# Altium project BaseStation.PrjPCB
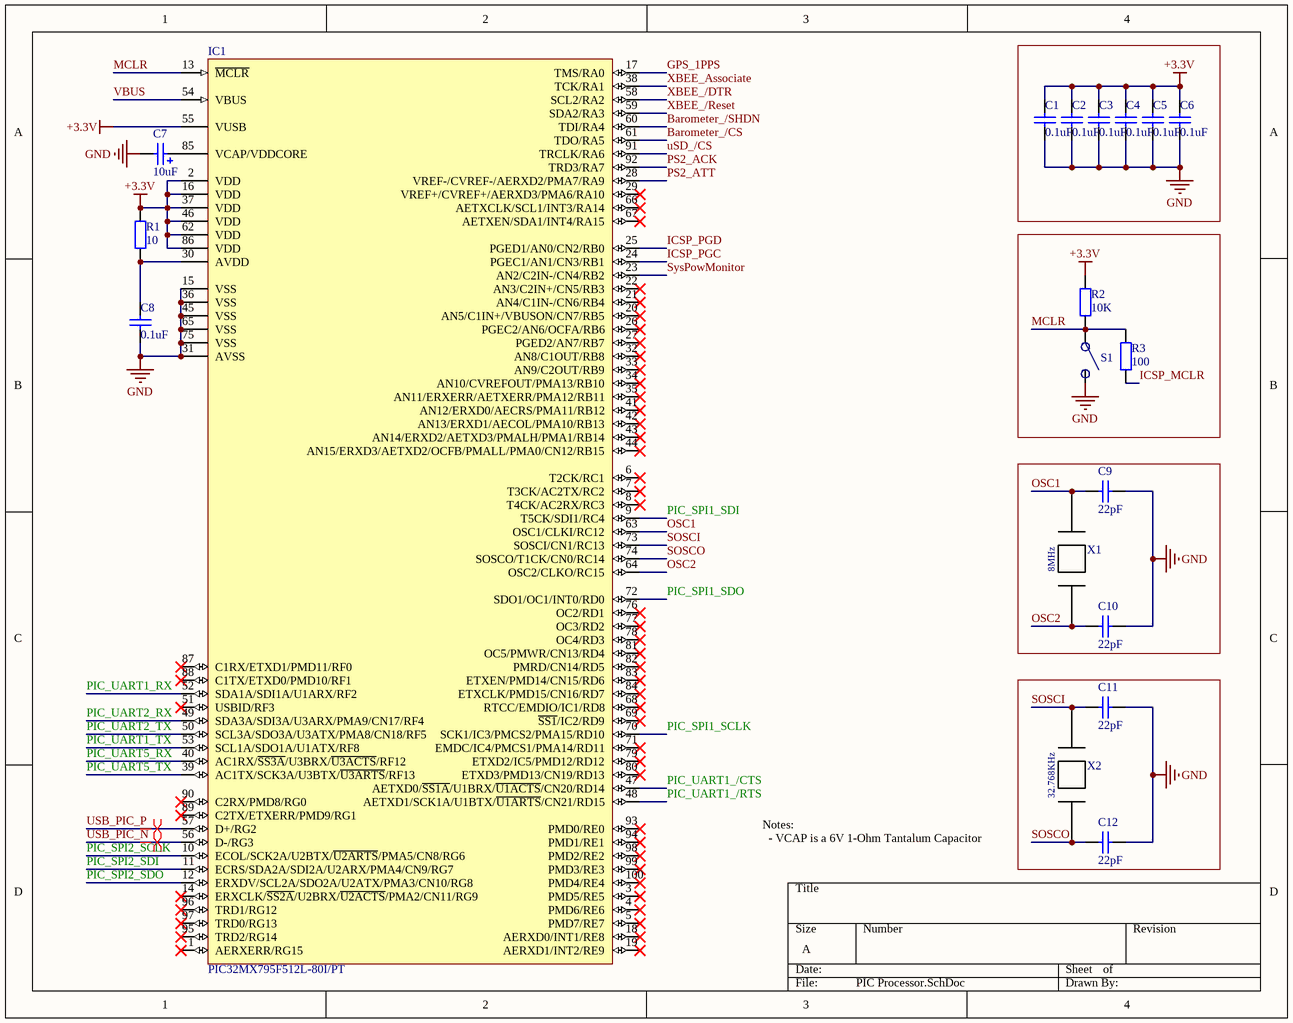
[diagram p0: PIC Processor.SchDoc]
4 sheets, 74 parts. Net scope: global (net labels, ports and power ports of the same name join across sheets).
Board file: Basestation.PcbDoc
Sheets:
  PIC Processor.SchDoc
  Connectors.SchDoc
  Power.SchDoc
  Modules.SchDoc

## Sheet PIC Processor.SchDoc
size A

### Parts
C1  value 0.1uF  [SMD 1206]  (hidden comment: 0.1uF SMD 1206)
C2  value 0.1uF  [SMD 1206]  (hidden comment: 0.1uF SMD 1206)
C3  value 0.1uF  [SMD 1206]  (hidden comment: 0.1uF SMD 1206)
C4  value 0.1uF  [SMD 1206]  (hidden comment: 0.1uF SMD 1206)
C5  value 0.1uF  [SMD 1206]  (hidden comment: 0.1uF SMD 1206)
C6  value 0.1uF  [SMD 1206]  (hidden comment: 0.1uF SMD 1206)
C7  value 10uF  [Capacitor - Tantalum Case A]  (hidden comment: 10uF Low-ESR Tantalum CaseA)
C8  value 0.1uF  [SMD 1206]  (hidden comment: 0.1uF SMD 1206)
C9  value 22pF  [SMD 1206]  (hidden comment: 22pF SMD 1206)
C10  value 22pF  [SMD 1206]  (hidden comment: 22pF SMD 1206)
C11  value 22pF  [SMD 1206]  (hidden comment: 22pF SMD 1206)
C12  value 22pF  [SMD 1206]  (hidden comment: 22pF SMD 1206)
IC1  PIC32MX795F512L-80I/PT  [TQFP-PF100_L]
R1  value 10  [SMD 0805]  (hidden comment: 10 SMD 0805)
R2  value 10K  [SMD 0805]  (hidden comment: 10K SMD 0805)
R3  value 100  [SMD 0805]  (hidden comment: 100 SMD 0805)
S1  Reset  [SMD Tactile Switch]  (value not drawn)
X1  XT9M20ANA8M  [XT9M20ANA8M - 8MHz Capacitor]  (value not drawn)
X2  SSP-T6-7PF-20PPM  [32.768KHz Crystal]  (value not drawn)

### Nets
+3.3V: C1.1 C2.1 C3.1 C4.1 C5.1 C6.1 IC1.2(VDD) IC1.16(VDD) IC1.37(VDD) IC1.46(VDD) IC1.55(VUSB) IC1.62(VDD) IC1.86(VDD) R1.2 R2.2
GND: C1.2 C2.2 C3.2 C4.2 C5.2 C6.2 C7.2(-) C8.2 C9.1 C10.1 C11.1 C12.1 IC1.15(VSS) IC1.31(AVSS) IC1.36(VSS) IC1.45(VSS) IC1.65(VSS) IC1.75(VSS) S1.1
Barometer_/CS: IC1.61(TDO/RA5)
Barometer_/SHDN: IC1.60(TDI/RA4)
GPS_1PPS: IC1.17(TMS/RA0)
ICSP_MCLR: R3.2
ICSP_PGC: IC1.24(PGEC1/AN1/CN3/RB1)
ICSP_PGD: IC1.25(PGED1/AN0/CN2/RB0)
MCLR: IC1.13(~{MCLR}) R2.1 R3.1 S1.2
OSC1: C9.2 IC1.63(OSC1/CLKI/RC12) X1.1
OSC2: C10.2 IC1.64(OSC2/CLKO/RC15) X1.0
PIC_SPI1_SCLK: IC1.70(SCK1/IC3/PMCS2/PMA15/RD10)
PIC_SPI1_SDI: IC1.9(T5CK/SDI1/RC4)
PIC_SPI1_SDO: IC1.72(SDO1/OC1/INT0/RD0)
PIC_SPI2_SCLK: IC1.10(ECOL/SCK2A/U2BTX/~{U2ARTS}/PMA5/CN8/RG6)
PIC_SPI2_SDI: IC1.11(ECRS/SDA2A/SDI2A/U2ARX/PMA4/CN9/RG7)
PIC_SPI2_SDO: IC1.12(ERXDV/SCL2A/SDO2A/U2ATX/PMA3/CN10/RG8)
PIC_UART1_/CTS: IC1.47(AETXD0/~{SS1A}/U1BRX/~{U1ACTS}/CN20/RD14)
PIC_UART1_/RTS: IC1.48(AETXD1/SCK1A/U1BTX/~{U1ARTS}/CN21/RD15)
PIC_UART1_RX: IC1.52(SDA1A/SDI1A/U1ARX/RF2)
PIC_UART1_TX: IC1.53(SCL1A/SDO1A/U1ATX/RF8)
PIC_UART2_RX: IC1.49(SDA3A/SDI3A/U3ARX/PMA9/CN17/RF4)
PIC_UART2_TX: IC1.50(SCL3A/SDO3A/U3ATX/PMA8/CN18/RF5)
PIC_UART5_RX: IC1.40(AC1RX/~{SS3A}/U3BRX/~{U3ACTS}/RF12)  [project net Bluetooth_TX]
PIC_UART5_TX: IC1.39(AC1TX/SCK3A/U3BTX/~{U3ARTS}/RF13)  [project net Bluetooth_RX]
PS2_ACK: IC1.92(TRD3/RA7)
PS2_ATT: IC1.28(VREF-/CVREF-/AERXD2/PMA7/RA9)
SOSCI: C11.2 IC1.73(SOSCI/CN1/RC13) X2.0
SOSCO: C12.2 IC1.74(SOSCO/T1CK/CN0/RC14) X2.1
SysPowMonitor: IC1.23(AN2/C2IN-/CN4/RB2)
USB_PIC_N: IC1.56(D-/RG3)
USB_PIC_P: IC1.57(D+/RG2)
uSD_/CS: IC1.91(TRCLK/RA6)
VBUS: IC1.54(VBUS)
XBEE_/DTR: IC1.58(SCL2/RA2)
XBEE_/Reset: IC1.59(SDA2/RA3)
XBEE_Associate: IC1.38(TCK/RA1)
NetC7_1: C7.1(+) IC1.85(VCAP/VDDCORE)
NetC8_1: C8.1 IC1.30(AVDD) R1.1

Not connected (* = marked no-connect by the designer): IC1 1(AERXERR/RG15)* 3(PMD5/RE5)* 4(PMD6/RE6)* 5(PMD7/RE7)* 6(T2CK/RC1)* 7(T3CK/AC2TX/RC2)* 8(T4CK/AC2RX/RC3)* 14(ERXCLK/~{SS2A}/U2BRX/~{U2ACTS}/PMA2/CN11/RG9)* 18(AERXD0/INT1/RE8)* 19(AERXD1/INT2/RE9)* 20(AN5/C1IN+/VBUSON/CN7/RB5)* 21(AN4/C1IN-/CN6/RB4)* 22(AN3/C2IN+/CN5/RB3)* 26(PGEC2/AN6/OCFA/RB6)* 27(PGED2/AN7/RB7)* 29(VREF+/CVREF+/AERXD3/PMA6/RA10)* 32(AN8/C1OUT/RB8)* 33(AN9/C2OUT/RB9)* 34(AN10/CVREFOUT/PMA13/RB10)* 35(AN11/ERXERR/AETXERR/PMA12/RB11)* 41(AN12/ERXD0/AECRS/PMA11/RB12)* 42(AN13/ERXD1/AECOL/PMA10/RB13)* 43(AN14/ERXD2/AETXD3/PMALH/PMA1/RB14)* 44(AN15/ERXD3/AETXD2/OCFB/PMALL/PMA0/CN12/RB15)* 51(USBID/RF3)* 66(AETXCLK/SCL1/INT3/RA14)* 67(AETXEN/SDA1/INT4/RA15)* 68(RTCC/EMDIO/IC1/RD8)* 69(~{SS1}/IC2/RD9)* 71(EMDC/IC4/PMCS1/PMA14/RD11)* 76(OC2/RD1)* 77(OC3/RD2)* 78(OC4/RD3)* 79(ETXD2/IC5/PMD12/RD12)* 80(ETXD3/PMD13/CN19/RD13)* 81(OC5/PMWR/CN13/RD4)* 82(PMRD/CN14/RD5)* 83(ETXEN/PMD14/CN15/RD6)* 84(ETXCLK/PMD15/CN16/RD7)* 87(C1RX/ETXD1/PMD11/RF0)* 88(C1TX/ETXD0/PMD10/RF1)* 89(C2TX/ETXERR/PMD9/RG1)* 90(C2RX/PMD8/RG0)* 93(PMD0/RE0)* 94(PMD1/RE1)* 95(TRD2/RG14)* 96(TRD1/RG12)* 97(TRD0/RG13)* 98(PMD2/RE2)* 99(PMD3/RE3)* 100(PMD4/RE4)*

### Layout directives
differential pair: USB_PIC_N, USB_PIC_P

### Notes on the sheet
- Notes:
  - VCAP is a 6V 1-Ohm Tantalum Capacitor
- (in symbol SSP-T6-7PF-20PPM) 32.768KHz
- (in symbol XT9M20ANA8M) 8MHz

### Library data of the parts
C1-C6 C8-C12 = Cap: Capacitor
C7 = SMD_Cap_Tantalum: Tantalum Capacitor - Case A
IC1 = PIC32MX795F512L-80I/PT: High Performance 80 MHz MIPS-Based 32-Bit Flash Microcontroller with USB, CAN and Ethernet, 512KB Program Memory, 100-pin TQFP, Industrial Temperature; Published: 2-Dec-2009; DatasheetVersion: revB, Nov-2009; PackageVersion: revBB, Aug-2009; PackageReference: TQFP-PT100; Publisher: Altium Limited; PackageDescription: 100-Lead Plastic Thin Quad Flatpack (PT) - 12x12x1mm Body, 2.00mm [TQFP]; Supplier 1: Digi-Key; Supplier Part Number 1: PIC32MX795F512L-80I/PT-ND; Supplier 2: Farnell; Supplier Part Number 2: 1778492; ComponentLink1Description: Datasheet; ComponentLink1URL: http://ww1.microchip.com/downloads/en/DeviceDoc/DS-61156B.pdf; ComponentLink2Description: Packaging Specification; ComponentLink2URL: http://ww1.microchip.com/downloads/en/PackagingSpec/en012702.pdf; ComponentLink3Description: Microchip.com Home; ComponentLink3URL: http://www.microchip.com/
R1-R3 = Res2: Resistor
S1 = SMD Tactile Switch
X1 = XT9M20ANA8M: 8MHz SMD Crystal; pin to pad: 0>1 1>2
X2 = SSP-T6-7PF-20PPM: 32.768KHz 7pF SMD Crystal; pin to pad: 0>1 1>2

## Sheet Connectors.SchDoc
size A
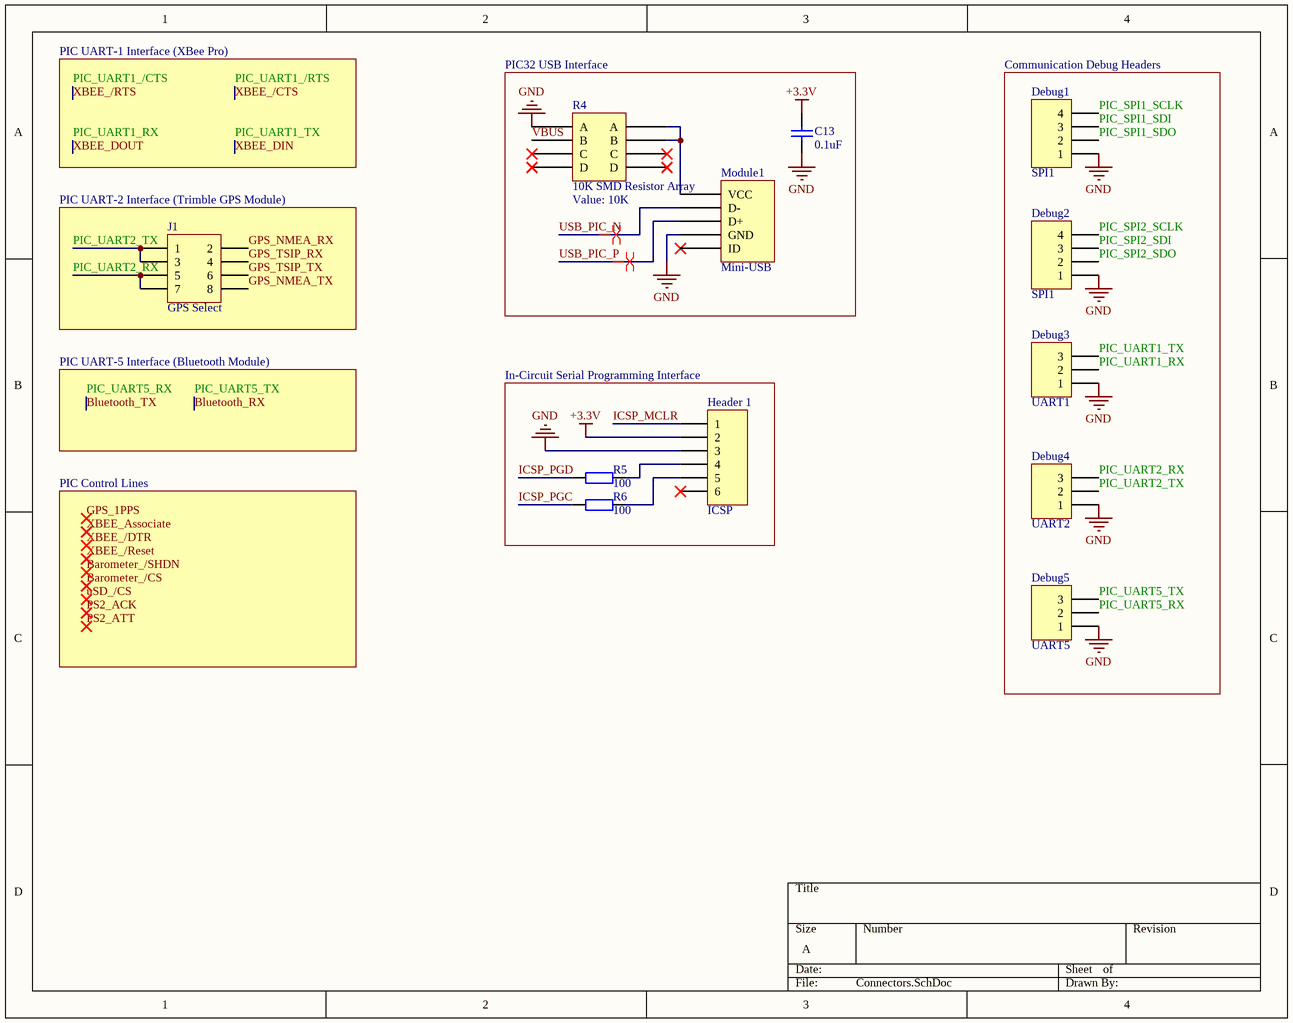
[diagram p1: Connectors.SchDoc]

### Parts
C13  value 0.1uF  [SMD 1206]  (hidden comment: 0.1uF SMD 1206)
Debug1  SPI1  [HDR1X4]
Debug2  SPI1  [HDR1X4]
Debug3  UART1  [HDR1X3]
Debug4  UART2  [HDR1X3]
Debug5  UART5  [HDR1X3]
Header_1  ICSP  [HDR1X6H]
J1  GPS Select  [HDR2X4]
Module1  Mini-USB  [Mini B USB Connector]
R4  10K SMD Resistor Array  value 10K  [Resistor Array YC164]
R5  value 100  [SMD 0805]  (hidden comment: 100 SMD 0805)
R6  value 100  [SMD 0805]  (hidden comment: 100 SMD 0805)

### Blocks framed on the sheet
PIC32 USB Interface: C13 Module1 R4
Communication Debug Headers: Debug1-Debug5
PIC UART-2 Interface (Trimble GPS Module): J1
In-Circuit Serial Programming Interface: Header_1 R5 R6

### Nets
+3.3V: C13.2 Header_1.2
GND: C13.1 Debug1.1 Debug2.1 Debug3.1 Debug4.1 Debug5.1 Header_1.3 Module1.0(GND) R4.5(A)
Bluetooth_RX: Debug5.3  [also labelled PIC_UART5_TX]
Bluetooth_TX: Debug5.2  [also labelled PIC_UART5_RX]
GPS_NMEA_RX: J1.2
GPS_NMEA_TX: J1.8
GPS_TSIP_RX: J1.4
GPS_TSIP_TX: J1.6
ICSP_MCLR: Header_1.1
ICSP_PGC: R6.2
ICSP_PGD: R5.2
PIC_SPI1_SCLK: Debug1.4
PIC_SPI1_SDI: Debug1.3
PIC_SPI1_SDO: Debug1.2
PIC_SPI2_SCLK: Debug2.4
PIC_SPI2_SDI: Debug2.3
PIC_SPI2_SDO: Debug2.2
PIC_UART1_RX: Debug3.2  [also labelled XBEE_DOUT]
PIC_UART1_TX: Debug3.3  [also labelled XBEE_DIN]
PIC_UART2_RX: Debug4.3 J1.5 J1.7
PIC_UART2_TX: Debug4.2 J1.1 J1.3
USB_PIC_N: Module1.3(D-)
USB_PIC_P: Module1.2(D+)
VBUS: R4.6(B)
NetHeader_1_4: Header_1.4 R5.1
NetHeader_1_5: Header_1.5 R6.1
NetModule1_4: Module1.4(VCC) R4.1(A) R4.2(B)

Not connected (* = marked no-connect by the designer): Header_1 6*; Module1 1(ID)*; R4 3(C)* 4(D)* 7(C)* 8(D)*

### Layout directives
differential pair: USB_PIC_N, USB_PIC_P

### Notes on the sheet
- PIC UART-1 Interface (XBee Pro)
- PIC UART-5 Interface (Bluetooth Module)
- PIC Control Lines
- Labels drawn without touching a wire or pin: Barometer_/CS, Barometer_/SHDN, GPS_1PPS, PS2_ACK, PS2_ATT, uSD_/CS, XBEE_/DTR, XBEE_/Reset, XBEE_Associate

### Library data of the parts
C13 = Cap: Capacitor
Debug1 Debug2 = Header 4: Header, 4-Pin; LatestRevisionDate: 17-Jul-2002; LatestRevisionNote: Re-released for DXP Platform.; Publisher: Altium Limited
Debug3-Debug5 = Header 3: Header, 3-Pin; LatestRevisionDate: 17-Jul-2002; LatestRevisionNote: Re-released for DXP Platform.; Publisher: Altium Limited
Header_1 = Header 6: Header, 6-Pin; LatestRevisionDate: 17-Jul-2002; LatestRevisionNote: Re-released for DXP Platform.; Publisher: Altium Limited
J1 = Header 4X2: Header, 4-Pin, Dual row; LatestRevisionDate: 17-Jul-2002; LatestRevisionNote: Re-released for DXP Platform.; Publisher: Altium Limited
Module1 = Mini USB Connector: pin to pad: 0>1 1>2 2>3 3>4 4>5
R4 = SMD Resistor Array: 4-Count Resistor Array; pin to pad: 5>8 6>7 7>6 8>5
R5 R6 = Res2: Resistor

## Sheet Power.SchDoc
size A
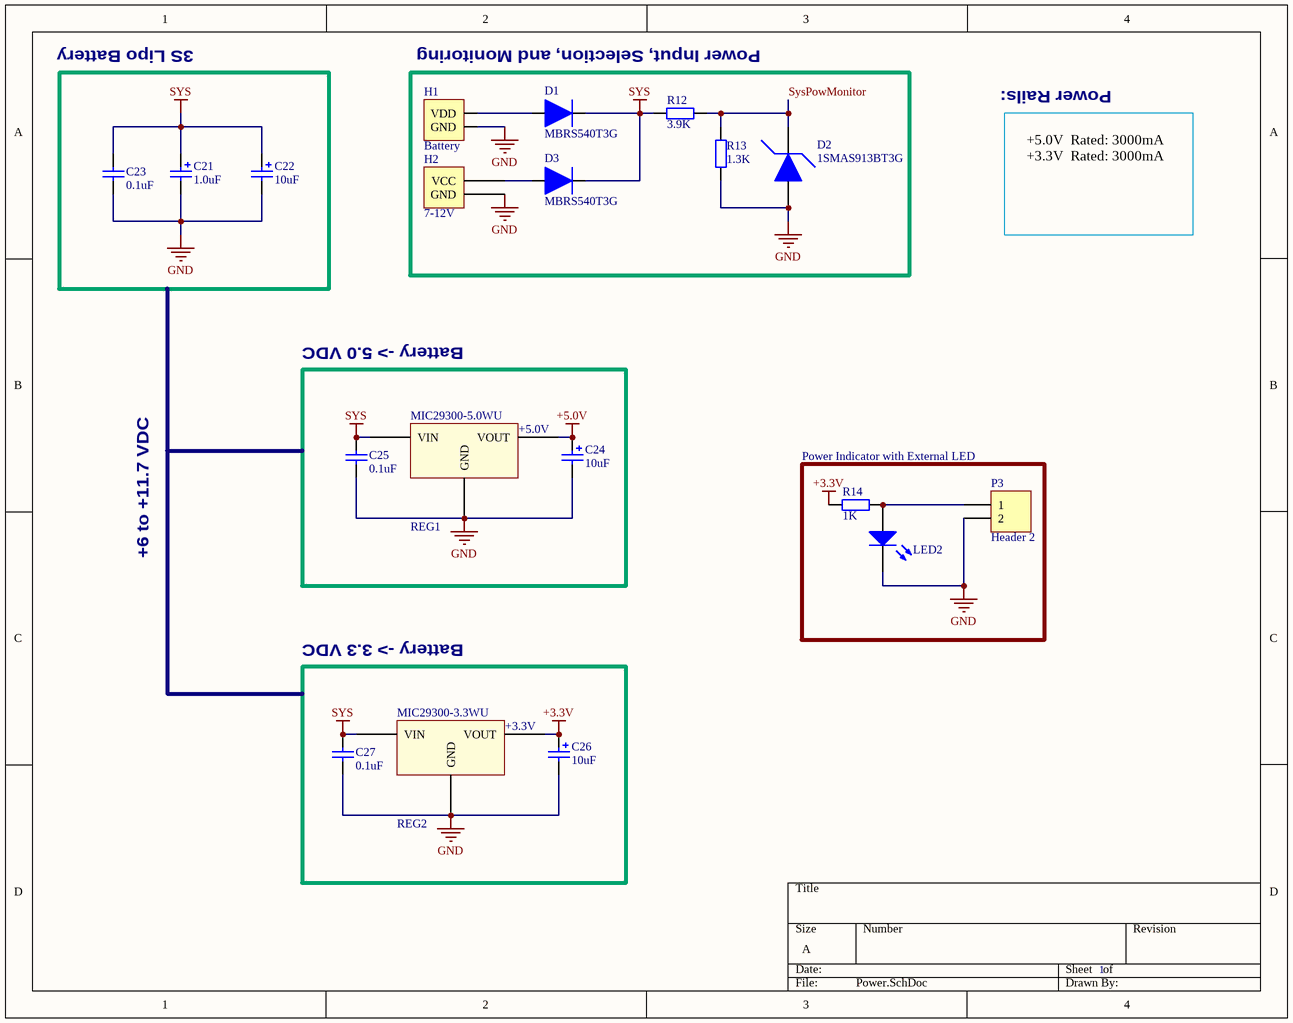
[diagram p2: Power.SchDoc]

### Parts
C21  value 1.0uF  [Capacitor - Tantalum Case A]  (hidden comment: 1.0uF Low-ESR Tantalum CaseA)
C22  value 10uF  [CAPPR2-5x5]  (hidden comment: 10uF Electrolitic)
C23  value 0.1uF  [SMD 1206]  (hidden comment: 0.1uF SMD 1206)
C24  value 10uF  [Capacitor - Tantalum Case A]  (hidden comment: 10uF Low-ESR Tantalum CaseA)
C25  value 0.1uF  [SMD 1206]  (hidden comment: 0.1uF SMD 1206)
C26  value 10uF  [Capacitor - Tantalum Case A]  (hidden comment: 10uF Low-ESR Tantalum CaseA)
C27  value 0.1uF  [SMD 1206]  (hidden comment: 0.1uF SMD 1206)
D1  MBRS540T3G  [MBRS540T3G]
D2  1SMAS913BT3G  [1SMA5913BT3G]
D3  MBRS540T3G  [MBRS540T3G]
H1  Battery  [PC Wire Connector]
H2  7-12V  [DC Power Jack]
LED2  ON  [PLCC-4 LED]  (value not drawn)
P3  Header 2  [HDR1X2]
R12  value 3.9K  [RES12.2-8.5X3.3]  (hidden comment: 3.9K Radial)
R13  value 1.3K  [RES12.2-8.5X3.3]  (hidden comment: 1.3K Radial)
R14  value 1K  [SMD 0805]  (hidden comment: 1K SMD 0805)
REG1  MIC29300-5.0WU  [TO-263 D2PACK]  (value not drawn)
REG2  MIC29300-3.3WU  [TO-263 D2PACK]  (value not drawn)

### Blocks framed on the sheet
Power Indicator with External LED: LED2 P3 R14

### Nets
+3.3V: C26.1(+) R14.1 REG2.2(VOUT)
+5.0V: C24.1(+) REG1.2(VOUT)
GND: C21.2(-) C22.2 C23.1 C24.2(-) C25.2 C26.2(-) C27.1 D2.0(In) H1.R(GND) H2.GND LED2.2(K) P3.2 R13.1 REG1.1(GND) REG2.1(GND)
SYS: C21.1(+) C22.1 C23.2 C25.1 C27.2 D1.1(Out) D3.1(Out) R12.2 REG1.0(VIN) REG2.0(VIN)
SysPowMonitor: D2.1(Out) R12.1 R13.2
NetD1_0: D1.0(In) H1.L(VDD)
NetD3_0: D3.0(In) H2.VCC
NetLED2_1: LED2.1(A) P3.1 R14.2

Not connected (* = marked no-connect by the designer): H2 NC

### Notes on the sheet
- 3S Lipo Battery
- Power Input, Selection, and Monitoring
- Power Rails:
- +5.0V  Rated: 3000mA
  +3.3V  Rated: 3000mA
- Battery -> 5.0 VDC
- +6 to +11.7 VDC
- Battery -> 3.3 VDC
- 1
- (in symbol MIC29300-3.3WU) +3.3V
- (in symbol MIC29300-5.0WU) +5.0V

### Library data of the parts
C21 C24 C26 = SMD_Cap_Tantalum: Tantalum Capacitor - Case A
C22 = Cap Pol1: Polarized Capacitor (Radial); Published: 8-Jun-2000; LatestRevisionDate: 17-Jul-2002; LatestRevisionNote: Re-released for DXP Platform.; PackageReference: RB7.6-15; Publisher: Altium Limited; PackageDescription: Polarized Capacitor (Radial); 2 Leads
C23 C25 C27 = Cap: Capacitor
D1 D3 = MBRS540T3G: 40V 5A Scottky Diode; pin to pad: 0>A 1>K
D2 = 1SMAS913BT3G: 3.3V 1.5W Zener Diode; pin to pad: 0>A 1>K
H1 = PC Wire Connector
H2 = DC Jack: DC Power Jack; pin to pad: GND>OUT VCC>IN
LED2 = SMD LED: Surface Mount Chip LED; pin to pad: 1>2 2>1
P3 = Header 2: Header, 2-Pin; LatestRevisionDate: 17-Jul-2002; LatestRevisionNote: Re-released for DXP Platform.; Publisher: Altium Limited
R12-R14 = Res2: Resistor
REG1 = MIC29300-5.0WU: 3.0A LDO Fixed Volt.(ROHS Compliant); pin to pad: 0>1 1>2 2>3
REG2 = MIC29300-3.3WU: 3.0A LDO Fixed Volt.(ROHS Compliant); pin to pad: 0>1 1>2 2>3

## Sheet Modules.SchDoc
size A
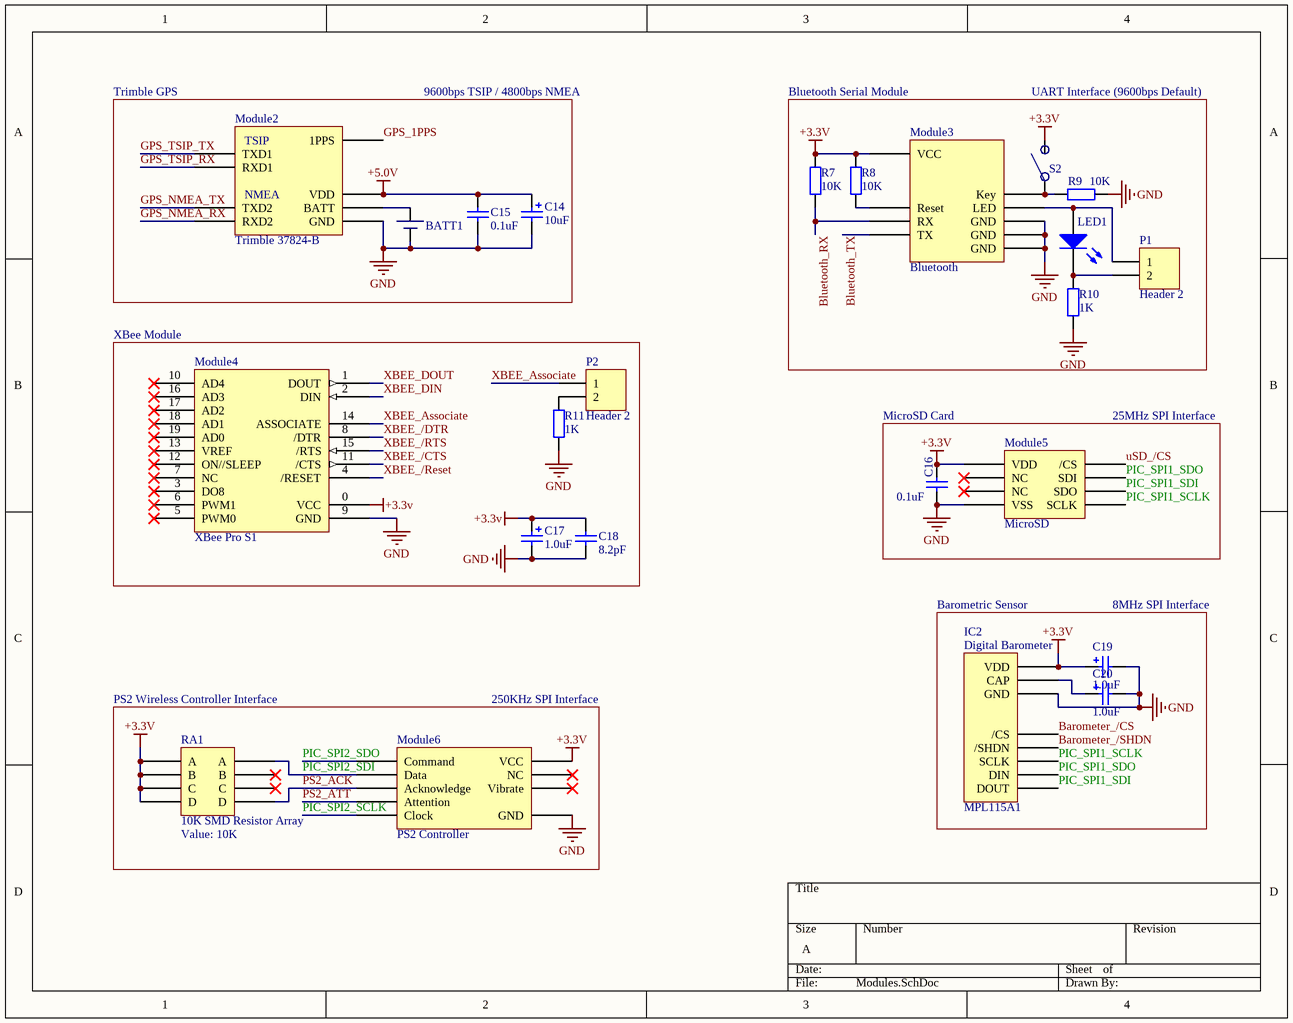
[diagram p3: Modules.SchDoc]

### Parts
BATT1  Coin Cell Holder  [Coil Cell Holder]  (value not drawn)
C14  value 10uF  [Capacitor - Tantalum Case A]  (hidden comment: 10uF Low-ESR Tantalum CaseA)
C15  value 0.1uF  [SMD 1206]  (hidden comment: 0.1uF SMD 1206)
C16  value 0.1uF  [SMD 1206]  (hidden comment: 0.1uF SMD 1206)
C17  value 1.0uF  [Capacitor - Tantalum Case A]  (hidden comment: 1.0uF Low-ESR Tantalum CaseA)
C18  value 8.2pF  [SMD 0805]  (hidden comment: 8.2pF SMD 0805)
C19  value 1.0uF  [Capacitor - Tantalum Case A]  (hidden comment: 1.0uF Low-ESR Tantalum CaseA)
C20  value 1.0uF  [Capacitor - Tantalum Case A]  (hidden comment: 1.0uF Low-ESR Tantalum CaseA)
IC2  MPL115A1  [MPL115A1]
LED1  Link  [PLCC-4 LED]  (value not drawn)
Module2  Trimble 37824-B  [Trimble 37824-B]
Module3  Bluetooth  [BT0417C Bluetooth Module]
Module4  XBee Pro S1  [XBee Pro S1 Wireless Module]
Module5  MicroSD  [MicroSD Card Slot]
Module6  PS2 Controller  [PS2 Wireless Module]
P1  Header 2  [HDR1X2]
P2  Header 2  [HDR1X2]
R7  value 10K  [SMD 0805]  (hidden comment: 10K SMD 0805)
R8  value 10K  [SMD 0805]  (hidden comment: 10K SMD 0805)
R9  value 10K  [SMD 0805]  (hidden comment: 10K SMD 0805)
R10  value 1K  [SMD 0805]  (hidden comment: 1K SMD 0805)
R11  value 1K  [SMD 0805]  (hidden comment: 1K SMD 0805)
RA1  10K SMD Resistor Array  value 10K  [Resistor Array YC164]
S2  Key  [SMD Tactile Switch]  (value not drawn)

### Blocks framed on the sheet
XBee Module: C17 C18 Module4 P2 R11

### Nets
+3.3V: C16.2 C17.1(+) C18.2 C19.1(+) IC2.0(VDD) Module3.4(VCC) Module4.0(VCC) Module5.3(VDD) Module6.5(VCC) R7.2 R8.1 RA1.5(A) RA1.6(B) RA1.7(C) RA1.8(D) S2.1
+5.0V: C14.1(+) C15.1 Module2.2(VDD)
GND: BATT1.NEG C14.2(-) C15.2 C16.1 C17.2(-) C18.1 C19.2(-) C20.2(-) IC2.2(GND) Module2.8(GND) Module3.5(GND) Module3.6(GND) Module3.7(GND) Module4.9(GND) Module5.5(VSS) Module6.4(GND) R9.1 R10.2 R11.2
Barometer_/CS: IC2.4(/CS)
Barometer_/SHDN: IC2.3(/SHDN)
Bluetooth_RX: Module3.2(RX) R7.1
Bluetooth_TX: Module3.1(TX)
GPS_1PPS: Module2.6(1PPS)
GPS_NMEA_RX: Module2.7(RXD2)
GPS_NMEA_TX: Module2.1(TXD2)
GPS_TSIP_RX: Module2.5(RXD1)
GPS_TSIP_TX: Module2.3(TXD1)
PIC_SPI1_SCLK: IC2.7(SCLK) Module5.4(SCLK)
PIC_SPI1_SDI: IC2.5(DOUT) Module5.6(SDO)
PIC_SPI1_SDO: IC2.6(DIN) Module5.2(SDI)
PIC_SPI2_SCLK: Module6.7(Clock)
PIC_SPI2_SDI: Module6.1(Data) RA1.1(A)
PIC_SPI2_SDO: Module6.2(Command)
PS2_ACK: Module6.9(Acknowledge) RA1.4(D)
PS2_ATT: Module6.6(Attention)
uSD_/CS: Module5.1(/CS)
XBEE_/CTS: Module4.11(/CTS)  [project net PIC_UART1_/RTS]
XBEE_/DTR: Module4.8(/DTR)
XBEE_/Reset: Module4.4(/RESET)
XBEE_/RTS: Module4.15(/RTS)  [project net PIC_UART1_/CTS]
XBEE_Associate: Module4.14(ASSOCIATE) P2.1
XBEE_DIN: Module4.2(DIN)  [project net PIC_UART1_TX]
XBEE_DOUT: Module4.1(DOUT)  [project net PIC_UART1_RX]
NetBATT1_POS: BATT1.POS Module2.4(BATT)
NetC20_1: C20.1(+) IC2.1(CAP)
NetLED1_1: LED1.1(A) Module3.8(LED) P1.1
NetLED1_2: LED1.2(K) P1.2 R10.1
NetModule3_3: Module3.3(Reset) R8.2
NetModule3_9: Module3.9(Key) R9.2 S2.2
NetP2_2: P2.2 R11.1

Not connected (* = marked no-connect by the designer): Module4 3(DO8)* 5(PWM0)* 6(PWM1)* 7(NC)* 10(AD4)* 12(ON//SLEEP)* 13(VREF)* 16(AD3)* 17(AD2)* 18(AD1)* 19(AD0)*; Module5 0(NC)* 7(NC)*; Module6 3(Vibrate)* 8(NC)*; RA1 2(B)* 3(C)*

### Notes on the sheet
- Trimble GPS
- 9600bps TSIP / 4800bps NMEA
- Bluetooth Serial Module
- UART Interface (9600bps Default)
- MicroSD Card
- (near Module5) 25MHz SPI Interface
- Barometric Sensor
- 8MHz SPI Interface
- PS2 Wireless Controller Interface
- 250KHz SPI Interface
- (in symbol MPL115A1) Digital Barometer
- (in symbol Trimble 37824-B) TSIP; NMEA

### Library data of the parts
BATT1 = Coin Cell Holder: Coin Cell Battery Holder
C14 C17 C19 C20 = SMD_Cap_Tantalum: Tantalum Capacitor - Case A
C15 C16 C18 = Cap: Capacitor
IC2 = MPL115A1: Miniature SPI Digital Barometer; pin to pad: 0>1 1>2 2>3 3>4 4>5 5>6 6>7 7>8
LED1 = SMD LED: pin to pad: 1>2 2>1
Module2 = Trimble 37824-B: Trimble 37824-B GPS Module
Module3 = Bluetooth SMD Module: Bluetooth SMD Serial Module; pin to pad: 3>11 4>12 5>13 6>21 7>22 8>24 9>26
Module4 = XBee Pro S1: XBee Pro S1 60mW Wireless Module; pin to pad: 0>1 1>2 2>3 3>4 4>5 5>6 6>7 7>8 8>9 9>10 10>11 11>12 12>13 13>14 14>15 15>16 16>17 17>18 18>19 19>20
Module5 = MicroSD Socket: MicroSD SPI Interface; pin to pad: 0>1 1>2 2>3 3>4 4>5 5>6 6>7 7>8; Supplier 1: Digi-Key
Module6 = PS2 Wireless Controller
P1 P2 = Header 2: Header, 2-Pin; LatestRevisionDate: 17-Jul-2002; LatestRevisionNote: Re-released for DXP Platform.; Publisher: Altium Limited
R7-R11 = Res2: Resistor
RA1 = SMD Resistor Array: 4-Count Resistor Array; pin to pad: 5>8 6>7 7>6 8>5
S2 = SMD Tactile Switch

## Nets that join several sheets
+3.3V: PIC Processor (15 pins), Connectors (C13.2 Header_1.2), Power (C26.1 R14.1 REG2.2), Modules (16 pins)
+5.0V: Power (C24.1 REG1.2), Modules (C14.1 C15.1 Module2.2)
GND: PIC Processor (19 pins), Connectors (9 pins), Power (15 pins), Modules (19 pins)
Barometer_/CS: PIC Processor (IC1.61), Modules (IC2.4)
Barometer_/SHDN: PIC Processor (IC1.60), Modules (IC2.3)
Bluetooth_RX: PIC Processor (IC1.39), Connectors (Debug5.3), Modules (Module3.2 R7.1)
Bluetooth_TX: PIC Processor (IC1.40), Connectors (Debug5.2), Modules (Module3.1)
GPS_1PPS: PIC Processor (IC1.17), Modules (Module2.6)
GPS_NMEA_RX: Connectors (J1.2), Modules (Module2.7)
GPS_NMEA_TX: Connectors (J1.8), Modules (Module2.1)
GPS_TSIP_RX: Connectors (J1.4), Modules (Module2.5)
GPS_TSIP_TX: Connectors (J1.6), Modules (Module2.3)
ICSP_MCLR: PIC Processor (R3.2), Connectors (Header_1.1)
ICSP_PGC: PIC Processor (IC1.24), Connectors (R6.2)
ICSP_PGD: PIC Processor (IC1.25), Connectors (R5.2)
PIC_SPI1_SCLK: PIC Processor (IC1.70), Connectors (Debug1.4), Modules (IC2.7 Module5.4)
PIC_SPI1_SDI: PIC Processor (IC1.9), Connectors (Debug1.3), Modules (IC2.5 Module5.6)
PIC_SPI1_SDO: PIC Processor (IC1.72), Connectors (Debug1.2), Modules (IC2.6 Module5.2)
PIC_SPI2_SCLK: PIC Processor (IC1.10), Connectors (Debug2.4), Modules (Module6.7)
PIC_SPI2_SDI: PIC Processor (IC1.11), Connectors (Debug2.3), Modules (Module6.1 RA1.1)
PIC_SPI2_SDO: PIC Processor (IC1.12), Connectors (Debug2.2), Modules (Module6.2)
PIC_UART1_/CTS: PIC Processor (IC1.47), Modules (Module4.15)
PIC_UART1_/RTS: PIC Processor (IC1.48), Modules (Module4.11)
PIC_UART1_RX: PIC Processor (IC1.52), Connectors (Debug3.2), Modules (Module4.1)
PIC_UART1_TX: PIC Processor (IC1.53), Connectors (Debug3.3), Modules (Module4.2)
PIC_UART2_RX: PIC Processor (IC1.49), Connectors (Debug4.3 J1.5 J1.7)
PIC_UART2_TX: PIC Processor (IC1.50), Connectors (Debug4.2 J1.1 J1.3)
PS2_ACK: PIC Processor (IC1.92), Modules (Module6.9 RA1.4)
PS2_ATT: PIC Processor (IC1.28), Modules (Module6.6)
SysPowMonitor: PIC Processor (IC1.23), Power (D2.1 R12.1 R13.2)
USB_PIC_N: PIC Processor (IC1.56), Connectors (Module1.3)
USB_PIC_P: PIC Processor (IC1.57), Connectors (Module1.2)
uSD_/CS: PIC Processor (IC1.91), Modules (Module5.1)
VBUS: PIC Processor (IC1.54), Connectors (R4.6)
XBEE_/DTR: PIC Processor (IC1.58), Modules (Module4.8)
XBEE_/Reset: PIC Processor (IC1.59), Modules (Module4.4)
XBEE_Associate: PIC Processor (IC1.38), Modules (Module4.14 P2.1)